# EAGLE schematic MCPGrundplatte16UniversalInputoutput (EAGLE 9.6.2)
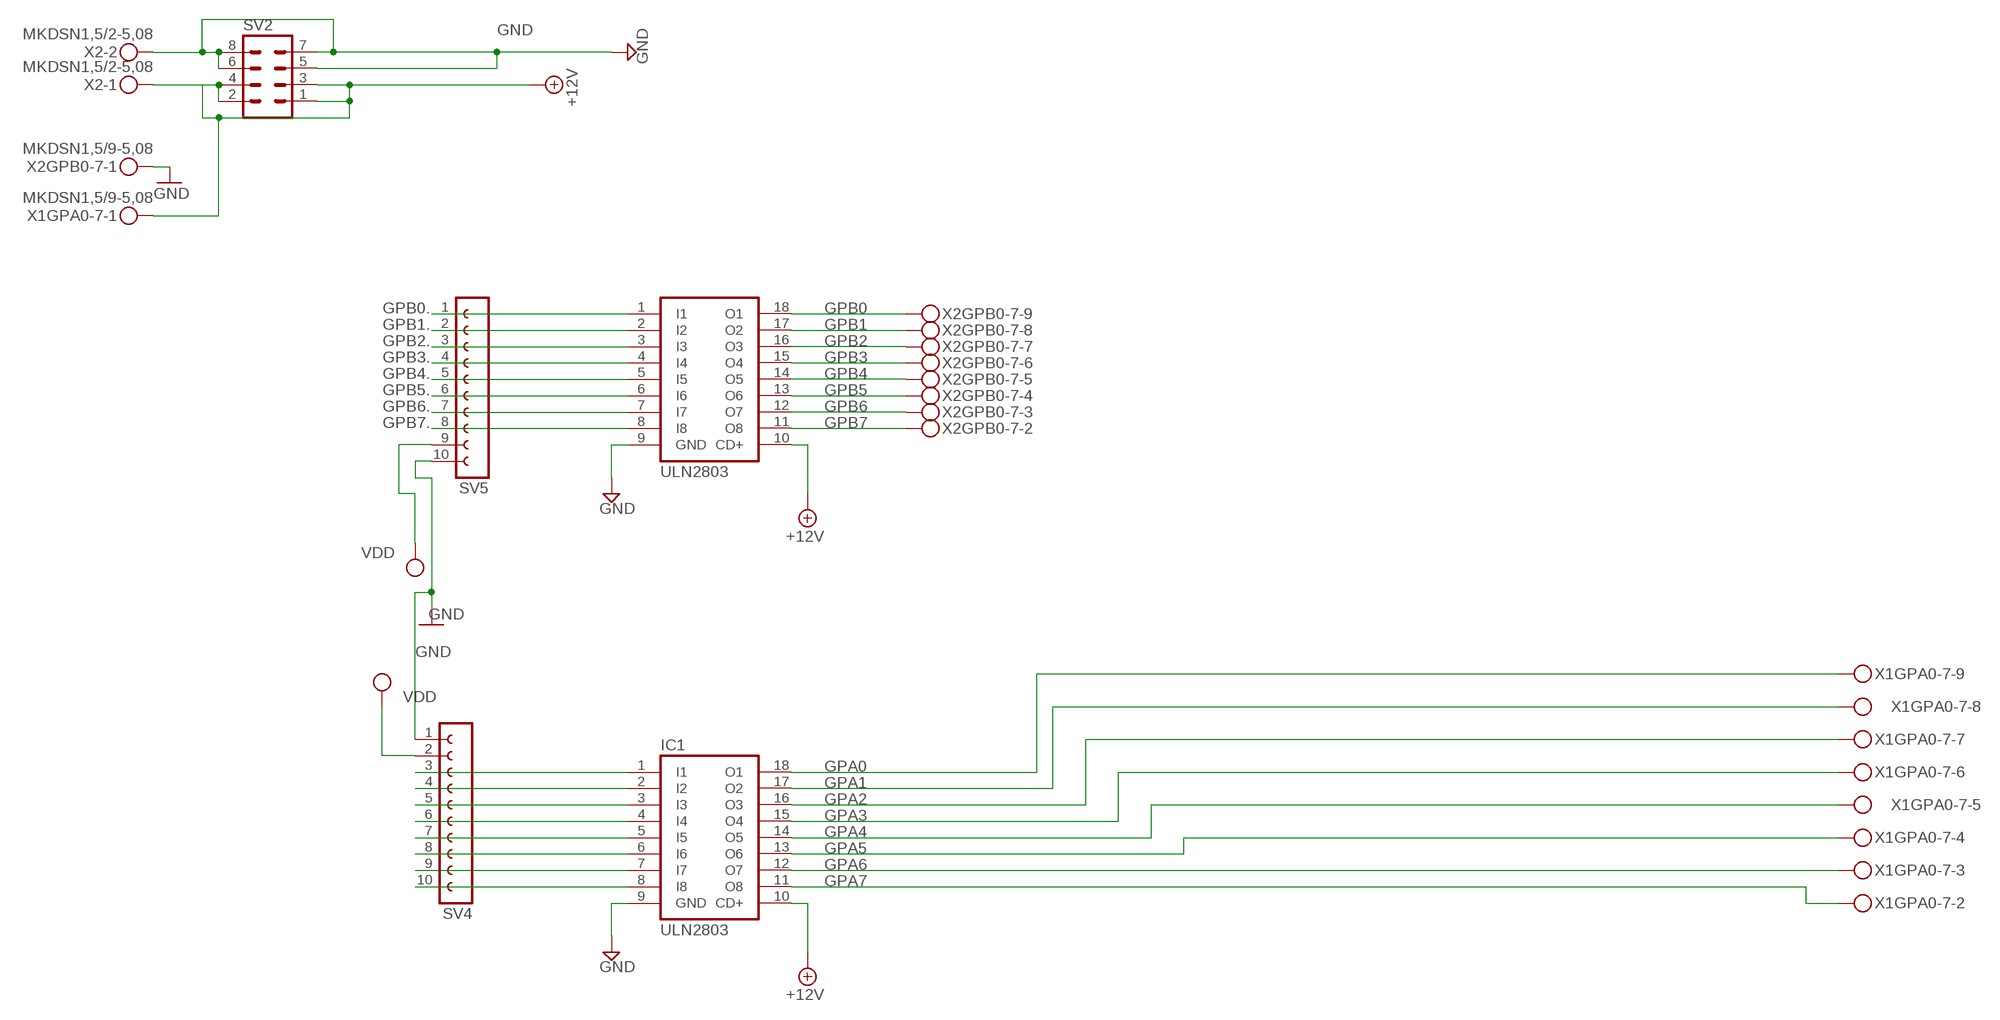
[diagram p0: schematic, sheet 1]

## Parts
IC1  ULN2803  ULN2803A  [DIL18]
IC4  ULN2803  ULN2803A  [DIL18]
SV2  MA04-2  [MA04-2]
SV4  FE10-1  [FE10]
SV5  FE10-1  [FE10]
X1GPA0-7  MKDSN1,5/9-5,08  [MKDSN1,5/9-5,08]
X2  MKDSN1,5/2-5,08  [MKDSN1,5/2-5,08]
X2GPB0-7  MKDSN1,5/9-5,08  [MKDSN1,5/9-5,08]

## Nets
+12V: IC1.10(CD+) IC4.10(CD+) SV2.1 SV2.2 SV2.3 SV2.4 X1GPA0-7.1 X2.1
GND: IC1.9(GND) IC4.9(GND) SV2.5 SV2.6 SV2.7 SV2.8 SV4.1 SV5.10 X2.2 X2GPB0-7.1
GPA0: IC1.18(O1) X1GPA0-7.9
GPA1: IC1.17(O2) X1GPA0-7.8
GPA2: IC1.16(O3) X1GPA0-7.7
GPA3: IC1.15(O4) X1GPA0-7.6
GPA4: IC1.14(O5) X1GPA0-7.5
GPA5: IC1.13(O6) X1GPA0-7.4
GPA6: IC1.12(O7) X1GPA0-7.3
GPA7: IC1.11(O8) X1GPA0-7.2
GPB0: IC4.18(O1) X2GPB0-7.9
GPB0.: IC4.1(I1) SV5.1
GPB1: IC4.17(O2) X2GPB0-7.8
GPB1.: IC4.2(I2) SV5.2
GPB2: IC4.16(O3) X2GPB0-7.7
GPB2.: IC4.3(I3) SV5.3
GPB3: IC4.15(O4) X2GPB0-7.6
GPB3.: IC4.4(I4) SV5.4
GPB4: IC4.14(O5) X2GPB0-7.5
GPB4.: IC4.5(I5) SV5.5
GPB5: IC4.13(O6) X2GPB0-7.4
GPB5.: IC4.6(I6) SV5.6
GPB6: IC4.12(O7) X2GPB0-7.3
GPB6.: IC4.7(I7) SV5.7
GPB7: IC4.11(O8) X2GPB0-7.2
GPB7.: IC4.8(I8) SV5.8
N$1: IC1.6(I6) SV4.8
N$2: IC1.1(I1) SV4.3
N$3: IC1.2(I2) SV4.4
N$4: IC1.3(I3) SV4.5
N$5: IC1.4(I4) SV4.6
N$6: IC1.5(I5) SV4.7
N$7: IC1.7(I7) SV4.9
N$8: IC1.8(I8) SV4.10
VDD: SV4.2 SV5.9

## Library data of the parts
IC1 IC4 = uln-udn:ULN2803A: DRIVER ARRAY
SV2 = con-lstb:MA04-2: PIN HEADER; OC_FARNELL: unknown; OC_NEWARK: unknown
SV4 SV5 = con-lsta:FE10-1: FEMALE HEADER; OC_FARNELL: unknown; OC_NEWARK: unknown
X1GPA0-7 X2GPB0-7 = con-phoenix-508:MKDSN1,5/9-5,08: MKDSN 1,5/ 9-5,08 Printklemme Nennstrom: 13,5 A Nennspannung: 250 V Rastermaß: 5,08 mm Polzahl: 9 Anschlussart: Schraubanschluss Montage: Löten Anschlussrichtung Leiter/Platine: 0 ° Artikelnummer: 1729199 Source: http://eshop.phoenixcontact.com .. 1729199.pdf
X2 = con-phoenix-508:MKDSN1,5/2-5,08: MKDSN 1,5/ 2-5,08 Printklemme Nennstrom: 13,5 A Nennspannung: 250 V Rastermaß: 5,08 mm Polzahl: 2 Anschlussart: Schraubanschluss Montage: Löten Anschlussrichtung Leiter/Platine: 0 ° Artikelnummer: 1729128 Source: http://eshop.phoenixcontact.com .. 1729128.pdf